# EAGLE schematic XBee_v1 (EAGLE 6.2)
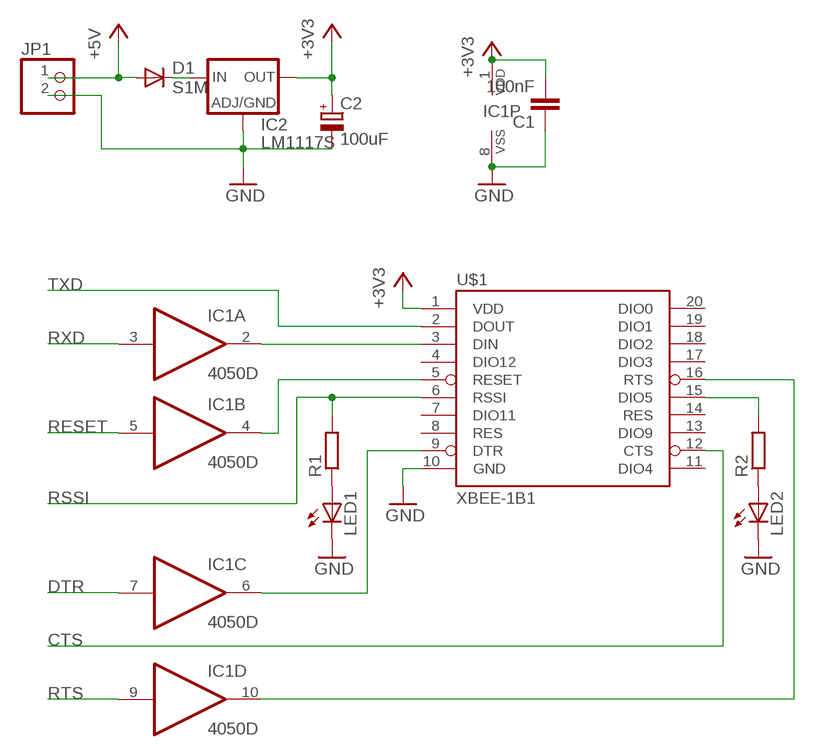
[diagram p0: schematic, sheet 1]

## Parts
C1  100nF  C-EUC0805K  [C0805K]
C2  100uF  CPOL-EUPD  [PANASONIC_D]
D1  S1M  [DO-214AC]
IC1  4050D  [SO16]
IC2  LM1117S  [SOT223]
JP1  PINHD-1X2  [1X02]
LED1  LED0805  [CHIP-LED0805]
LED2  LED0805  [CHIP-LED0805]
R1  R-EU_R0805  [R0805]
R2  R-EU_R0805  [R0805]
U$1  XBEE-1B1  [XBEE-1]

## Nets
+3V3: C1.2 C2.+ IC1.1(P:VDD) IC2.2(OUT) IC2.4(OUT) U$1.1(VDD)
+5V: D1.A JP1.1
CTS: U$1.12(CTS)
DTR: IC1.7(C:I)
GND: C1.1 C2.- IC1.8(P:VSS) IC2.1(ADJ) JP1.2 LED1.C LED2.C U$1.10(GND)
N$1: D1.C IC2.3(IN)
N$3: IC1.2(A:O) U$1.3(DIN)
N$4: IC1.4(B:O) U$1.5(RESET)
N$6: LED1.A R1.1
N$7: IC1.6(C:O) U$1.9(DTR)
N$8: IC1.10(D:O) U$1.16(RTS)
N$9: LED2.A R2.1
N$10: R2.2 U$1.15(DIO5)
RESET: IC1.5(B:I)
RSSI: R1.2 U$1.6(RSSI)
RTS: IC1.9(D:I)
RXD: IC1.3(A:I)
TXD: U$1.2(DOUT)
Unconnected: IC1.11(E:I) IC1.12(E:O) IC1.14(F:I) IC1.15(F:O) U$1.4(DIO12) U$1.7(DIO11) U$1.8(RES) U$1.11(DIO4) U$1.13(DIO9) U$1.14(RES) U$1.17(DIO3) U$1.18(DIO2) U$1.19(DIO1) U$1.20(DIO0)

## Library data of the parts
C1 = mark_1:C-EU: CAPACITOR, European symbol
C2 = mark_1:CPOL-EU: POLARIZED CAPACITOR, European symbol
D1 = mark_1:S1M
IC1 = mark_1:4050: Hex non-inverting BUFFER
IC2 = mark_1:LM1117: Low drop fixed and adjustable positive voltage regulators 1 A Source: http://www.st.com/stonline/products/literature/ds/7194/ld1117axx.pdf
JP1 = mark_1:PINHD-1X2: PIN HEADER
LED1 LED2 = mark_1:LED
R1 R2 = mark_1:R-EU_: RESISTOR, European symbol
U$1 = mark_1:XBEE-1